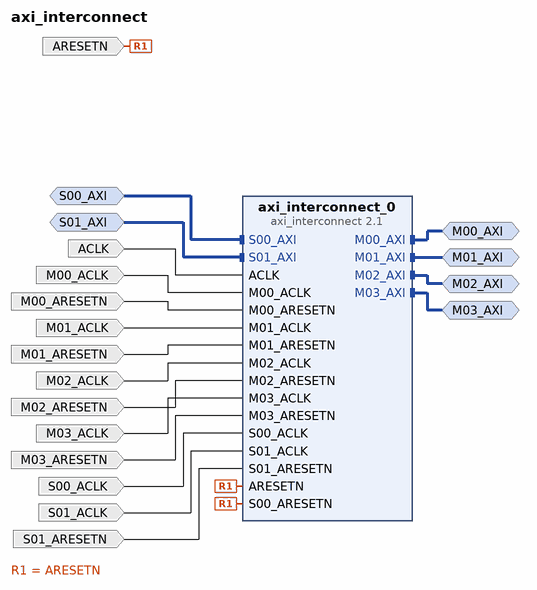
[diagram p0: block diagram of the top level]
# Vivado block design axi_interconnect, xcvu9p-flgb2104-2-e, Vivado 2025.2
create_bd_design axi_interconnect

create_bd_intf_port -mode Master -vlnv xilinx.com:interface:aximm_rtl:1.0 M00_AXI
set_property -dict [list \
  CONFIG.ADDR_WIDTH 64 \
  CONFIG.DATA_WIDTH 512 \
  CONFIG.FREQ_HZ 250000000 \
  CONFIG.NUM_READ_OUTSTANDING 2 \
  CONFIG.NUM_WRITE_OUTSTANDING 2 \
  CONFIG.PROTOCOL AXI4 \
] [get_bd_intf_ports M00_AXI]
create_bd_intf_port -mode Master -vlnv xilinx.com:interface:aximm_rtl:1.0 M01_AXI
set_property -dict [list \
  CONFIG.ADDR_WIDTH 64 \
  CONFIG.DATA_WIDTH 512 \
  CONFIG.FREQ_HZ 250000000 \
  CONFIG.NUM_READ_OUTSTANDING 2 \
  CONFIG.NUM_WRITE_OUTSTANDING 2 \
  CONFIG.PROTOCOL AXI4 \
] [get_bd_intf_ports M01_AXI]
create_bd_intf_port -mode Master -vlnv xilinx.com:interface:aximm_rtl:1.0 M02_AXI
set_property -dict [list \
  CONFIG.ADDR_WIDTH 64 \
  CONFIG.DATA_WIDTH 512 \
  CONFIG.FREQ_HZ 250000000 \
  CONFIG.NUM_READ_OUTSTANDING 2 \
  CONFIG.NUM_WRITE_OUTSTANDING 2 \
  CONFIG.PROTOCOL AXI4 \
] [get_bd_intf_ports M02_AXI]
create_bd_intf_port -mode Master -vlnv xilinx.com:interface:aximm_rtl:1.0 M03_AXI
set_property -dict [list \
  CONFIG.ADDR_WIDTH 64 \
  CONFIG.DATA_WIDTH 512 \
  CONFIG.FREQ_HZ 250000000 \
  CONFIG.NUM_READ_OUTSTANDING 2 \
  CONFIG.NUM_WRITE_OUTSTANDING 2 \
  CONFIG.PROTOCOL AXI4 \
] [get_bd_intf_ports M03_AXI]
create_bd_intf_port -mode Slave -vlnv xilinx.com:interface:aximm_rtl:1.0 S00_AXI
set_property -dict [list \
  CONFIG.ADDR_WIDTH 35 \
  CONFIG.ARUSER_WIDTH 0 \
  CONFIG.AWUSER_WIDTH 0 \
  CONFIG.BUSER_WIDTH 0 \
  CONFIG.DATA_WIDTH 512 \
  CONFIG.FREQ_HZ 250000000 \
  CONFIG.HAS_BRESP 1 \
  CONFIG.HAS_BURST 1 \
  CONFIG.HAS_CACHE 1 \
  CONFIG.HAS_LOCK 1 \
  CONFIG.HAS_PROT 1 \
  CONFIG.HAS_QOS 1 \
  CONFIG.HAS_REGION 1 \
  CONFIG.HAS_RRESP 1 \
  CONFIG.HAS_WSTRB 1 \
  CONFIG.ID_WIDTH 0 \
  CONFIG.MAX_BURST_LENGTH 256 \
  CONFIG.NUM_READ_OUTSTANDING 2 \
  CONFIG.NUM_READ_THREADS 1 \
  CONFIG.NUM_WRITE_OUTSTANDING 2 \
  CONFIG.NUM_WRITE_THREADS 1 \
  CONFIG.PROTOCOL AXI4 \
  CONFIG.READ_WRITE_MODE READ_WRITE \
  CONFIG.RUSER_BITS_PER_BYTE 0 \
  CONFIG.RUSER_WIDTH 0 \
  CONFIG.SUPPORTS_NARROW_BURST 1 \
  CONFIG.WUSER_BITS_PER_BYTE 0 \
  CONFIG.WUSER_WIDTH 0 \
] [get_bd_intf_ports S00_AXI]
create_bd_intf_port -mode Slave -vlnv xilinx.com:interface:aximm_rtl:1.0 S01_AXI
set_property -dict [list \
  CONFIG.ADDR_WIDTH 35 \
  CONFIG.ARUSER_WIDTH 0 \
  CONFIG.AWUSER_WIDTH 0 \
  CONFIG.BUSER_WIDTH 0 \
  CONFIG.DATA_WIDTH 512 \
  CONFIG.FREQ_HZ 250000000 \
  CONFIG.HAS_BRESP 1 \
  CONFIG.HAS_BURST 1 \
  CONFIG.HAS_CACHE 1 \
  CONFIG.HAS_LOCK 1 \
  CONFIG.HAS_PROT 1 \
  CONFIG.HAS_QOS 1 \
  CONFIG.HAS_REGION 1 \
  CONFIG.HAS_RRESP 1 \
  CONFIG.HAS_WSTRB 1 \
  CONFIG.ID_WIDTH 0 \
  CONFIG.MAX_BURST_LENGTH 256 \
  CONFIG.NUM_READ_OUTSTANDING 2 \
  CONFIG.NUM_READ_THREADS 1 \
  CONFIG.NUM_WRITE_OUTSTANDING 2 \
  CONFIG.NUM_WRITE_THREADS 1 \
  CONFIG.PROTOCOL AXI4 \
  CONFIG.READ_WRITE_MODE READ_WRITE \
  CONFIG.RUSER_BITS_PER_BYTE 0 \
  CONFIG.RUSER_WIDTH 0 \
  CONFIG.SUPPORTS_NARROW_BURST 1 \
  CONFIG.WUSER_BITS_PER_BYTE 0 \
  CONFIG.WUSER_WIDTH 0 \
] [get_bd_intf_ports S01_AXI]
create_bd_port -dir I -type clk ACLK
set_property -dict {CONFIG.FREQ_HZ 250000000} [get_bd_ports ACLK]
create_bd_port -dir I -type rst ARESETN
create_bd_port -dir I -type clk M00_ACLK
set_property -dict {CONFIG.FREQ_HZ 250000000} [get_bd_ports M00_ACLK]
create_bd_port -dir I -type rst M00_ARESETN
create_bd_port -dir I -type clk M01_ACLK
set_property -dict {CONFIG.FREQ_HZ 250000000} [get_bd_ports M01_ACLK]
create_bd_port -dir I -type rst M01_ARESETN
create_bd_port -dir I -type clk M02_ACLK
set_property -dict {CONFIG.FREQ_HZ 250000000} [get_bd_ports M02_ACLK]
create_bd_port -dir I -type rst M02_ARESETN
create_bd_port -dir I -type clk M03_ACLK
set_property -dict {CONFIG.FREQ_HZ 250000000} [get_bd_ports M03_ACLK]
create_bd_port -dir I -type rst M03_ARESETN
set_property -dict {CONFIG.POLARITY ACTIVE_LOW} [get_bd_ports M03_ARESETN]
create_bd_port -dir I -type clk S00_ACLK
set_property -dict {CONFIG.FREQ_HZ 250000000} [get_bd_ports S00_ACLK]
create_bd_port -dir I -type clk S01_ACLK
set_property -dict {CONFIG.FREQ_HZ 250000000} [get_bd_ports S01_ACLK]
create_bd_port -dir I -type rst S01_ARESETN

create_bd_cell -type ip -vlnv xilinx.com:ip:axi_interconnect:2.1 axi_interconnect_0
set_property -dict [list \
  CONFIG.ENABLE_ADVANCED_OPTIONS 1 \
  CONFIG.M00_HAS_REGSLICE 4 \
  CONFIG.M01_HAS_REGSLICE 4 \
  CONFIG.M02_HAS_REGSLICE 4 \
  CONFIG.M03_HAS_REGSLICE 4 \
  CONFIG.NUM_MI 4 \
  CONFIG.NUM_SI 2 \
  CONFIG.S00_HAS_REGSLICE 4 \
  CONFIG.S01_HAS_REGSLICE 4 \
] [get_bd_cells axi_interconnect_0]

# ---- connections ----

connect_bd_intf_net [get_bd_intf_ports S00_AXI] [get_bd_intf_pins axi_interconnect_0/S00_AXI]
connect_bd_intf_net [get_bd_intf_ports S01_AXI] [get_bd_intf_pins axi_interconnect_0/S01_AXI]
connect_bd_intf_net [get_bd_intf_ports M00_AXI] [get_bd_intf_pins axi_interconnect_0/M00_AXI]
connect_bd_intf_net [get_bd_intf_ports M01_AXI] [get_bd_intf_pins axi_interconnect_0/M01_AXI]
connect_bd_intf_net [get_bd_intf_ports M02_AXI] [get_bd_intf_pins axi_interconnect_0/M02_AXI]
connect_bd_intf_net [get_bd_intf_ports M03_AXI] [get_bd_intf_pins axi_interconnect_0/M03_AXI]
connect_bd_net [get_bd_ports ACLK] [get_bd_pins axi_interconnect_0/ACLK]
connect_bd_net [get_bd_ports ARESETN] [get_bd_pins axi_interconnect_0/ARESETN] [get_bd_pins axi_interconnect_0/S00_ARESETN]
connect_bd_net [get_bd_ports M00_ACLK] [get_bd_pins axi_interconnect_0/M00_ACLK]
connect_bd_net [get_bd_ports M00_ARESETN] [get_bd_pins axi_interconnect_0/M00_ARESETN]
connect_bd_net [get_bd_ports M01_ACLK] [get_bd_pins axi_interconnect_0/M01_ACLK]
connect_bd_net [get_bd_ports M01_ARESETN] [get_bd_pins axi_interconnect_0/M01_ARESETN]
connect_bd_net [get_bd_ports M02_ACLK] [get_bd_pins axi_interconnect_0/M02_ACLK]
connect_bd_net [get_bd_ports M02_ARESETN] [get_bd_pins axi_interconnect_0/M02_ARESETN]
connect_bd_net [get_bd_ports M03_ACLK] [get_bd_pins axi_interconnect_0/M03_ACLK]
connect_bd_net [get_bd_ports M03_ARESETN] [get_bd_pins axi_interconnect_0/M03_ARESETN]
connect_bd_net [get_bd_ports S00_ACLK] [get_bd_pins axi_interconnect_0/S00_ACLK]
connect_bd_net [get_bd_ports S01_ACLK] [get_bd_pins axi_interconnect_0/S01_ACLK]
connect_bd_net [get_bd_ports S01_ARESETN] [get_bd_pins axi_interconnect_0/S01_ARESETN]

# ---- address map ----
assign_bd_address -offset 0x000000000 -range 8G -target_address_space [get_bd_addr_spaces S00_AXI] [get_bd_addr_segs M00_AXI/Reg]
assign_bd_address -offset 0x200000000 -range 8G -target_address_space [get_bd_addr_spaces S00_AXI] [get_bd_addr_segs M01_AXI/Reg]
assign_bd_address -offset 0x400000000 -range 8G -target_address_space [get_bd_addr_spaces S00_AXI] [get_bd_addr_segs M02_AXI/Reg]
assign_bd_address -offset 0x600000000 -range 8G -target_address_space [get_bd_addr_spaces S00_AXI] [get_bd_addr_segs M03_AXI/Reg]
assign_bd_address -offset 0x000000000 -range 8G -target_address_space [get_bd_addr_spaces S01_AXI] [get_bd_addr_segs M00_AXI/Reg]
assign_bd_address -offset 0x200000000 -range 8G -target_address_space [get_bd_addr_spaces S01_AXI] [get_bd_addr_segs M01_AXI/Reg]
assign_bd_address -offset 0x400000000 -range 8G -target_address_space [get_bd_addr_spaces S01_AXI] [get_bd_addr_segs M02_AXI/Reg]
assign_bd_address -offset 0x600000000 -range 8G -target_address_space [get_bd_addr_spaces S01_AXI] [get_bd_addr_segs M03_AXI/Reg]

validate_bd_design
save_bd_design
